# EAGLE design bbc (EAGLE 9.6.2)
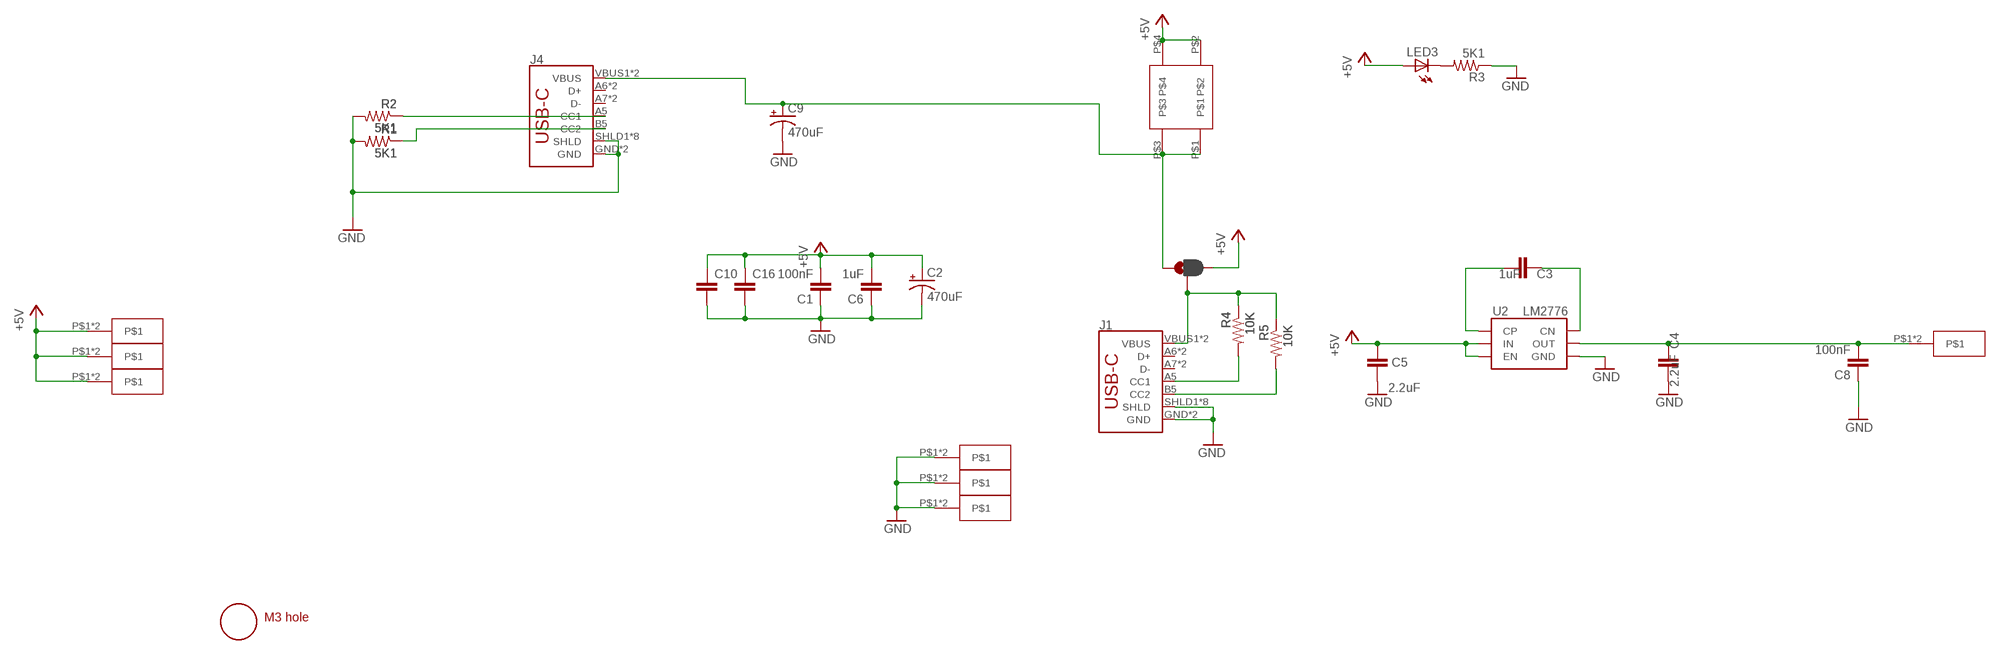
[diagram p0: schematic, sheet 1]

## Parts
C1  100nF  CAP0805  [0805@1]
C2  470uF  CPOL-USSMCD  [SMC_D]
C3  1uF  CAP0805  [0805@1]
C4  2.2uF  CAP0805  [0805@1]
C5  2.2uF  CAP0805  [0805@1]
C6  1uF  CAP0805  [0805@1]
C8  100nF  CAP0805  [0805@1]
C9  470uF  CPOL-USSMCD  [SMC_D]
C10  C5/2.5  [C5B2.5]
C16  C5/2.5  [C5B2.5]
J1  USB_C16PIN  [USB-C-16P]
J4  USB_C16PIN  [USB-C-16P]
JP1  JUMPER-SMT_3_1-NC_PASTE_NO-SILK  [SMT-JUMPER_3_1-NC_PASTE_NO-SILK]
LED3  LEDCHIP-LED0805  [CHIP-LED0805]
R1  5K1  RESISTOR0805-RES  [0805]
R2  5K1  RESISTOR0805-RES  [0805]
R3  5K1  RESISTOR0805-RES  [0805]
R4  10K  RESISTOR0805-RES  [0805]
R5  10K  RESISTOR0805-RES  [0805]
U2  LM2776  [SOT-23-6]
U$3  ROCK_SW  [ROCK_SWITCH]
U$4  M3_MOUNTING_HOLE  [M3_MOUNTING_HOLE_PACK]
U$5  BLADE28  [2.8BLADE]
U$6  BLADE28  [2.8BLADE]
U$7  BLADE28  [2.8BLADE]
U$8  BLADE28  [2.8BLADE]
U$9  BLADE28  [2.8BLADE]
U$10  BLADE28  [2.8BLADE]
U$11  BLADE28  [2.8BLADE]

## Nets
+5V: C1.2 C2.+ C5.1 C6.2 C10.1 C16.1 JP1.3 LED3.A U2.3(IN) U2.4(EN) U$3.P$2 U$3.P$4 U$6.P$1 U$6.P$2 U$7.P$1 U$7.P$2 U$8.P$1 U$8.P$2
GND: C1.1 C2.- C4.2 C5.2 C6.1 C8.1 C9.- C10.2 C16.2 J1.GND J1.GND2(GND) J1.SHLD1(SHLD) J1.SHLD2(SHLD) J1.SHLD3(SHLD) J1.SHLD4(SHLD) J1.SHLD5(SHLD) J1.SHLD6(SHLD) J1.SHLD7(SHLD) J1.SHLD8(SHLD) J4.GND J4.GND2(GND) J4.SHLD1(SHLD) J4.SHLD2(SHLD) J4.SHLD3(SHLD) J4.SHLD4(SHLD) J4.SHLD5(SHLD) J4.SHLD6(SHLD) J4.SHLD7(SHLD) J4.SHLD8(SHLD) R1.2 R2.2 R3.1 U2.2(GND) U$9.P$1 U$9.P$2 U$10.P$1 U$10.P$2 U$11.P$1 U$11.P$2
N$1: C9.+ J4.VBUS1(VBUS) J4.VBUS2(VBUS) JP1.1 U$3.P$1 U$3.P$3
N$2: C3.2 U2.5(CP)
N$3: C3.1 U2.6(CN)
N$4: C4.1 C8.2 U2.1(OUT) U$5.P$1 U$5.P$2
N$5: J1.VBUS1(VBUS) J1.VBUS2(VBUS) JP1.2 R4.1 R5.1
N$6: J4.A5(CC1) R2.1
N$7: LED3.C R3.2
N$8: J1.B5(CC2) R5.2
N$9: J1.A5(CC1) R4.2
N$31: J4.B5(CC2) R1.1
Unconnected: J1.A6(D+) J1.A7(D-) J1.B6(D+) J1.B7(D-) J4.A6(D+) J4.A7(D-) J4.B6(D+) J4.B7(D-)

## Library data of the parts
C1 C3-C6 C8 = clock:CAP: Capacitor Standard 0603 ceramic capacitor, and 0.1" leaded capacitor.
C2 C9 = rcl:CPOL-US: POLARIZED CAPACITOR, American symbol; SPICEPREFIX: C
C10 C16 = capacitor-wima:C: CAPACITOR naming: grid - package width
J1 J4 = SparkFun-Connectors:USB_C: USB Type C 16Pin Connector Super Speed pins not available on the 16-pin purely SMD connector so this part is best for USB 2.0 implementations. D1 and D2 are tied together enabling D+/- no matter which way the cable is plugged into the connector. The two channel configuration pins (CC1/2) are exposed. These are normally connected to ground via 5.1k resistors but can be reconfigured for high current/high power applications.; PROD_ID: CONN-14122
JP1 = SparkFun-Jumpers:JUMPER-SMT_3_1-NC_PASTE: Normally closed solder jumper (1 of 2 connections) This jumper has an aperture in the stencil to allow solder paste to bridge one of the two connections. One connection is normally closed (NC), while the other is normally open (NO). Wick off the solder to open the connection. Reapply solder to reclose the connection. Apply solder to the other side instead to change the current path.
LED3 = adafruit:LED: LED OSRAM: - CHIPLED LG R971, LG N971, LY N971, LG Q971, LY Q971, LO R971, LY R971 LH N974, LH R974 LS Q976, LO Q976, LY Q976 LO Q996 - Hyper CHIPLED LW Q18S LB Q993, LB Q99A, LB R99A - SideLED LS A670, LO A670, LY A670, LG A670, LP A670 LB A673, LV A673, LT A673, LW A673 LH A674 LY A675 LS A676, LA A676, LO A676, LY A676, LW A676 LS A679, LY A679, LG A679 - Hyper Micro SIDELED® LS Y876, LA Y876, LO Y876, LY Y876 LT Y87S - SmartLED LW L88C, LW L88S LB L89C, LB L89S, LG L890 LS L89K, LO L89K, LY L89K LS L896, LA L896, LO L896, LY L896 - TOPLED LS T670, LO T670, LY T670, LG T670, LP T670 LSG T670, LSP T670, LSY T670, LOP T670, LYG T670 LG T671, LOG T671, LSG T671 LB T673, LV T673, LT T673, LW T673 LH T674 LS T676, LA T676, LO T676, LY T676, LB T676, LH T676, LSB T676, LW T676 LB T67C, LV T67C, LT T67C, LS T67K, LO T67K, LY T67K, LW E67C LS E67B, LA E67B, LO E67B, LY E67B, LB E67C, LV E67C, LT E67C LW T67C LS T679, LY T679, LG T679 LS T770, LO T770, LY T770, LG T770, LP T770 LB T773, LV T773, LT T773, LW T773 LH T774 LS E675, LA E675, LY E675, LS T675 LS T776, LA T776, LO T776, LY T776, LB T776 LHGB T686 LT T68C, LB T68C - Hyper Mini TOPLED® LB M676 - Mini TOPLED Santana® LG M470 LS M47K, LO M47K, LY M47K Source: http://www.osram.convergy.de/
R1-R5 = atx_power_control:RESISTOR: Resistor Basic schematic elements and footprints for 0603, 1206, and PTH resistors.
U2 = dword1511-pmic-dcdc:LM2776: Switched capacitor inverter
U$3 = atx4vc:ROCK_SW
U$4 = a:M3_MOUNTING_HOLE
U$5-U$11 = blade:BLADE28

## Board
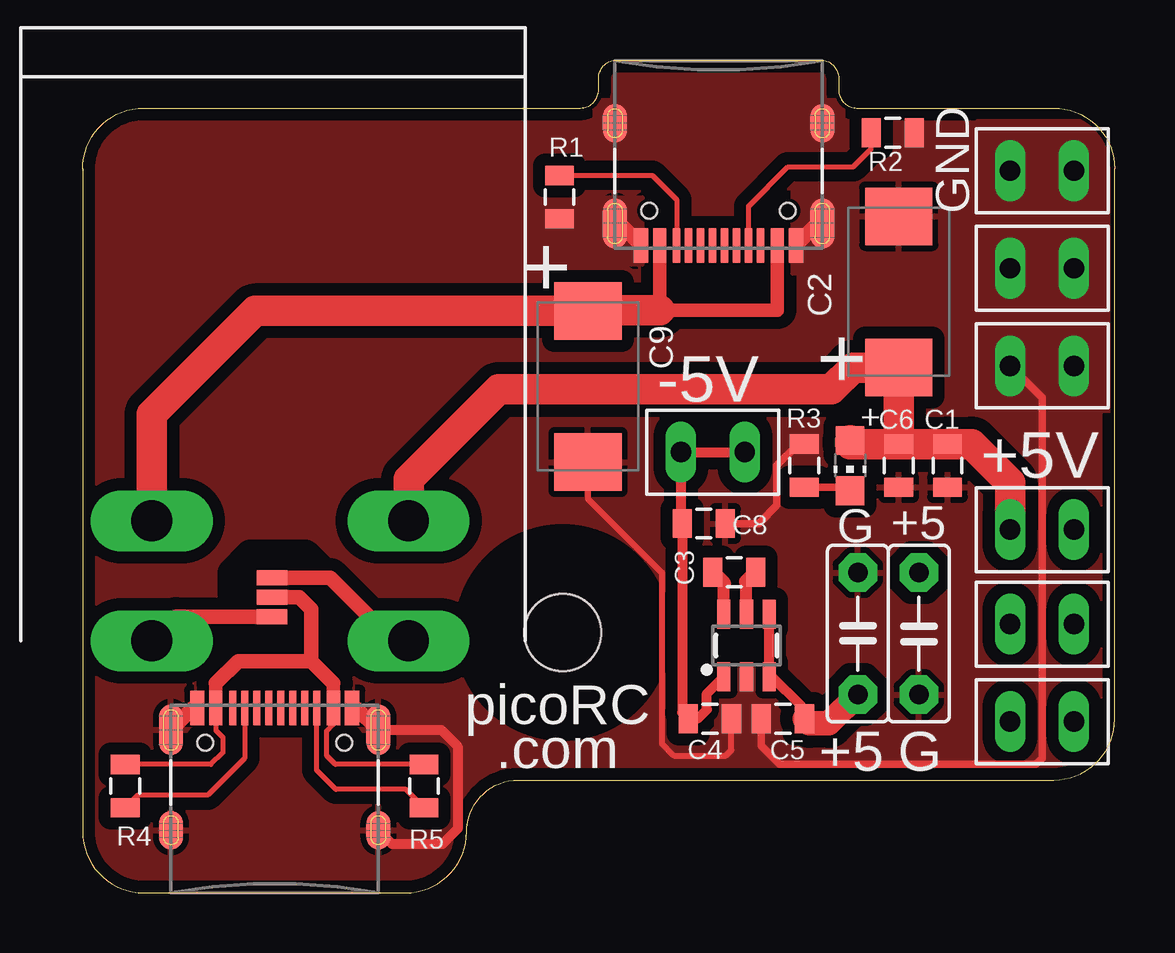
[diagram p1: board, top side]
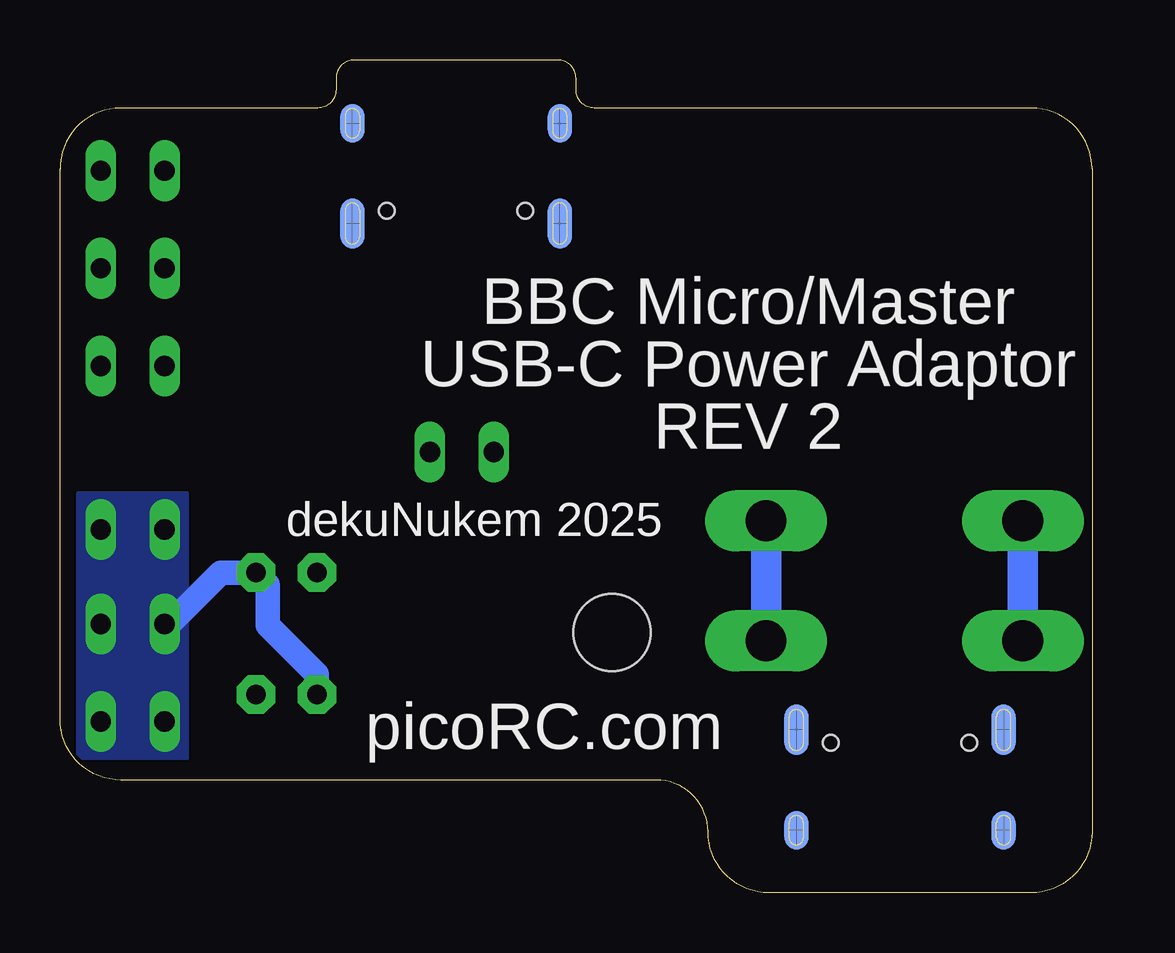
[diagram p2: board, bottom side, seen from below]

Size 43 x 34.7 mm. Coordinates in mm from the lower left corner, seen from the top.
Outline: 32.26,32.7 40.46,32.7 arc-90 43,30.16 43,7.24 arc-90 40.46,4.7 18.16,4.7 arc90 16,2.54 arc-90 13.46,0 2.54,0 arc-90 0,2.54 0,30.16 arc-90 2.54,32.7 20.74,32.7 arc90 21.5,33.46 21.5,33.94 arc-90 22.26,34.7 30.74,34.7 arc-90 31.5,33.94 31.5,33.46 arc90 32.26,32.7
Copper layers (1*16): Top 0.035mm / dielectric 1.5mm / Bottom 0.035mm
Design rules "SparkFun-2-Layer-General-JLCPCB": minimum track width 7mil, minimum drill 0.3mm, track to track 7mil, track to pad 7mil, pad to pad 7mil, via to via 7mil, smd to smd 7mil, copper to edge 7mil, drill to drill 7mil, minimum pad ring 7mil, minimum via ring 7mil, stop-mask expansion 3mil, vias tented up to drill 25mil, thermal gap 10mil
tRestrict: area 16,6.9 to 24,14.9; area 26.9,9.8 to 28.3,10.8; area 6.2,10.8 to 10.2,14.1

### Footprints (pad centres in the part's own frame; a part is rotated, then mirrored left to right if it is on the bottom)
0805@1 = smd 0.8 x 1.2: 1 -0.9,0; 2 0.9,0
SMC_D = smd 2.4 x 2.8: + -3.15,0; - 3.15,0
C5B2.5 = drill 0.813 pad 1.6 octagon: 1 -2.54,0; 2 2.54,0
USB-C-16P = smd 0.3 x 1.45: A5 -1.25,0; A6 -0.25,0; A7 0.25,0; A8 1.25,0; B5 1.75,0; B6 0.75,0; B7 -0.75,0; B8 -1.75,0 | smd 0.6 x 1.45: GND -3.225,0; GND2 3.225,0 | smd 1 x 2.1: SHLD1 -4.32,-0.915; SHLD2 4.32,-0.915 | smd 1 x 2.1 bottom: SHLD3 -4.32,-0.915; SHLD4 4.32,-0.915 | smd 1 x 1.6: SHLD5 -4.32,-5.095; SHLD8 4.32,-5.095 | smd 1 x 1.6 bottom: SHLD6 -4.32,-5.095; SHLD7 4.32,-5.095 | smd 0.55 x 1.45: VBUS1 -2.45,0; VBUS2 2.45,0 | hole 0.65: -2.89,-1.445; 2.89,-1.445
SMT-JUMPER_3_1-NC_PASTE_NO-SILK = smd 0.635 x 1.27: 1 -0.813,0; 2 0,0; 3 0.813,0
CHIP-LED0805 = smd 1.2 x 1.2: A 0,-1.05; C 0,1.05
0805 = smd 0.8 x 1.2: 1 -0.9,0; 2 0.9,0
SOT-23-6 = smd 0.55 x 1.2: 1 -0.95,-1.3; 2 0,-1.3; 3 0.95,-1.3; 4 0.95,1.3; 5 0,1.3; 6 -0.95,1.3
ROCK_SWITCH = drill 1.7 long: P$1 -5.05,0; P$2 5.65,0; P$3 -5.05,5; P$4 5.65,5
M3_MOUNTING_HOLE_PACK = hole 3.2: 0,0
2.8BLADE = drill 0.85 long: P$1 -1.33,0; P$2 1.33,0

### Placement (x,y rotation side)
C1  36.04,17.8 90 top
C2  34.01,25.04 90 top
C3  27.15,13.35 0 top
C4  26.13,7.26 0 top
C5  29.18,7.26 180 top
C6  34.01,17.8 90 top
C8  25.88,15.38 180 top
C9  21.05,21.1 270 top
C10  34.84,10.8 270 top
C16  32.3,10.8 90 top
J1  8,7.7 0 top
J4  26.5,26.97 180 top
JP1  7.88,12.32 90 top
LED3  31.97,17.8 180 top
R1  19.87,28.99 270 top
R2  33.75,31.67 0 top
R3  30.07,17.8 270 top
R4  1.78,4.45 270 top
R5  14.22,4.45 270 top
U2  27.66,10.3 0 top
U$3  7.93,10.5 0 top
U$4  20,10.85 0 top
U$5  26.26,18.37 180 top
U$6  39.97,15.13 0 top
U$7  39.97,11.2 0 top
U$8  39.97,7.13 0 top
U$9  39.97,30.09 0 top
U$10  39.97,26.02 0 top
U$11  39.97,21.96 0 top

### Tracks (layer width: path | path; a pad name or v marks a point on that pad's centre or on a via)
+5V
  Top 0.406: C5.1 29.95,7.38 29.95,7.76 28.71,9 U2.3 U2.4
  Top 0.61: JP1.3 10.31,13.13 12.95,10.5 U$3.P$2
  Top 1.016: C5.1 30.28,7.06 31.1,7.06 C16.1
  Top 1.27: LED3.A 31.97,18.7 C6.2 | C6.2 C1.2 37.04,18.7 38.64,17.09 U$6.P$1 | U$3.P$4 13.58,17.22 17.33,20.97 31.19,20.97 32.1,21.89 C2.+ C6.2
  Bottom 1.016: U$7.P$1 38.44,11.2 36.3,13.34 C10.1 34.34,12.84 34.34,11.14 32.3,9.1 C16.1
  Bottom 1.27: U$3.P$4 U$3.P$2
  pour Bottom (no thermals): 37.69,16.65 42.26,16.65 42.26,5.61 37.69,5.61
GND
  Top 0.254: C9.- 21.05,16.41 24.13,13.34 24.13,6.22 24.64,5.72 26.8,5.72 27.03,5.95 C4.2
  Top 0.305: U$11.P$1 39.97,20.63 39.97,5.61 39.72,5.35 29.05,5.35 28.28,6.12 C5.2 | R3.1 29.81,18.7 28.93,17.81 28.93,16.15 28.16,15.38 C8.1
  Top 0.406: J1.SHLD4 14.93,6.79 15.62,6.1 15.62,2.67 14.99,2.03 12.89,2.03 J1.SHLD8
  Top 0.61: J4.GND2 22.36,27.89 J4.SHLD4 | J4.GND 30.64,27.89 J4.SHLD1 | J1.GND2 11.4,7.7 J1.SHLD4 | J1.SHLD3 4.59,7.7 J1.GND
  pour Top (isolate 0.508): 59,34.68 -9,34.68 -9,-10.37 59,-10.31
  pour Top (no thermals): 37.31,32.15 42.77,32.15 42.77,20.08 37.31,20.08
  pour Top (no thermals): 29.56,29.23 31.59,29.23 31.59,25.8 29.56,25.8
  pour Top (no thermals): 21.43,28.97 21.43,26.18 23.34,26.18 23.34,28.97
  pour Top (no thermals): 29.94,33.04 31.72,33.04 31.72,31 29.94,31
  pour Top (no thermals): 21.3,33.04 23.08,33.04 23.08,31 21.3,31
  pour Top (isolate 0.305, no thermals): 28.93,9.67 28.93,6.11 26.39,6.11 26.39,9.67
N$1
  Top 0.559: J4.VBUS2 24.05,24.27 28.95,24.27 J4.VBUS1
  Top 0.61: U$3.P$1 3.89,11.51 JP1.1
  Top 1.27: U$3.P$3 2.88,19.95 7.18,24.25 C9.+ 21.08,24.27 24.05,24.27
  Bottom 1.27: U$3.P$3 U$3.P$1
N$2
  Top 0.508: U2.5 27.66,12.96
  Top 0.61: 27.66,12.96 C3.2
N$3
  Top 0.508: U2.6 26.7,12.89
  Top 0.61: 26.7,12.89 C3.1
N$4
  Top 0.406: U2.1 26,8.3 26,7.64 25.62,7.26 C4.1 24.98,7.51 C8.2 24.93,15.43 U$5.P$2 U$5.P$1
N$5
  Top 0.203: J1.VBUS1 5.55,6.77 5.84,6.48 5.84,5.84 5.34,5.35 R4.1 | R5.1 10.53,5.35 10.16,5.72 10.16,6.73 10.45,7.02 J1.VBUS2
  Top 0.559: 5.55,8.73 J1.VBUS1 | 10.45,8.73 J1.VBUS2
  Top 0.61: JP1.2 9.02,12.32 9.53,11.81 9.53,9.65 | 9.53,9.65 10.45,8.73 | 9.53,9.65 6.48,9.65 5.55,8.73
N$6
  Top 0.203: J4.A5 27.75,28.61 29.38,30.24 32.1,30.24 32.85,30.99 R2.1
N$7
  Top 0.305: R3.2 31.97,16.9 LED3.C
N$8
  Top 0.203: R5.2 13.46,4.31 10.55,4.31 9.75,5.11 J1.B5
N$9
  Top 0.203: J1.A5 6.75,5.61 5.21,4.07 2.3,4.07 R4.2
N$31
  Top 0.203: J4.B5 24.75,28.88 23.74,29.89 R1.1

### Text on the board
tNames: GND | + | + | -5V | +5V | G | +5 | picoRC / .com | +5 | G
bNames: BBC Micro/Master / USB-C Power Adaptor / REV 2 | dekuNukem 2025 | picoRC.com